# EAGLE design LEDmatrixboard (EAGLE 7.2.0)
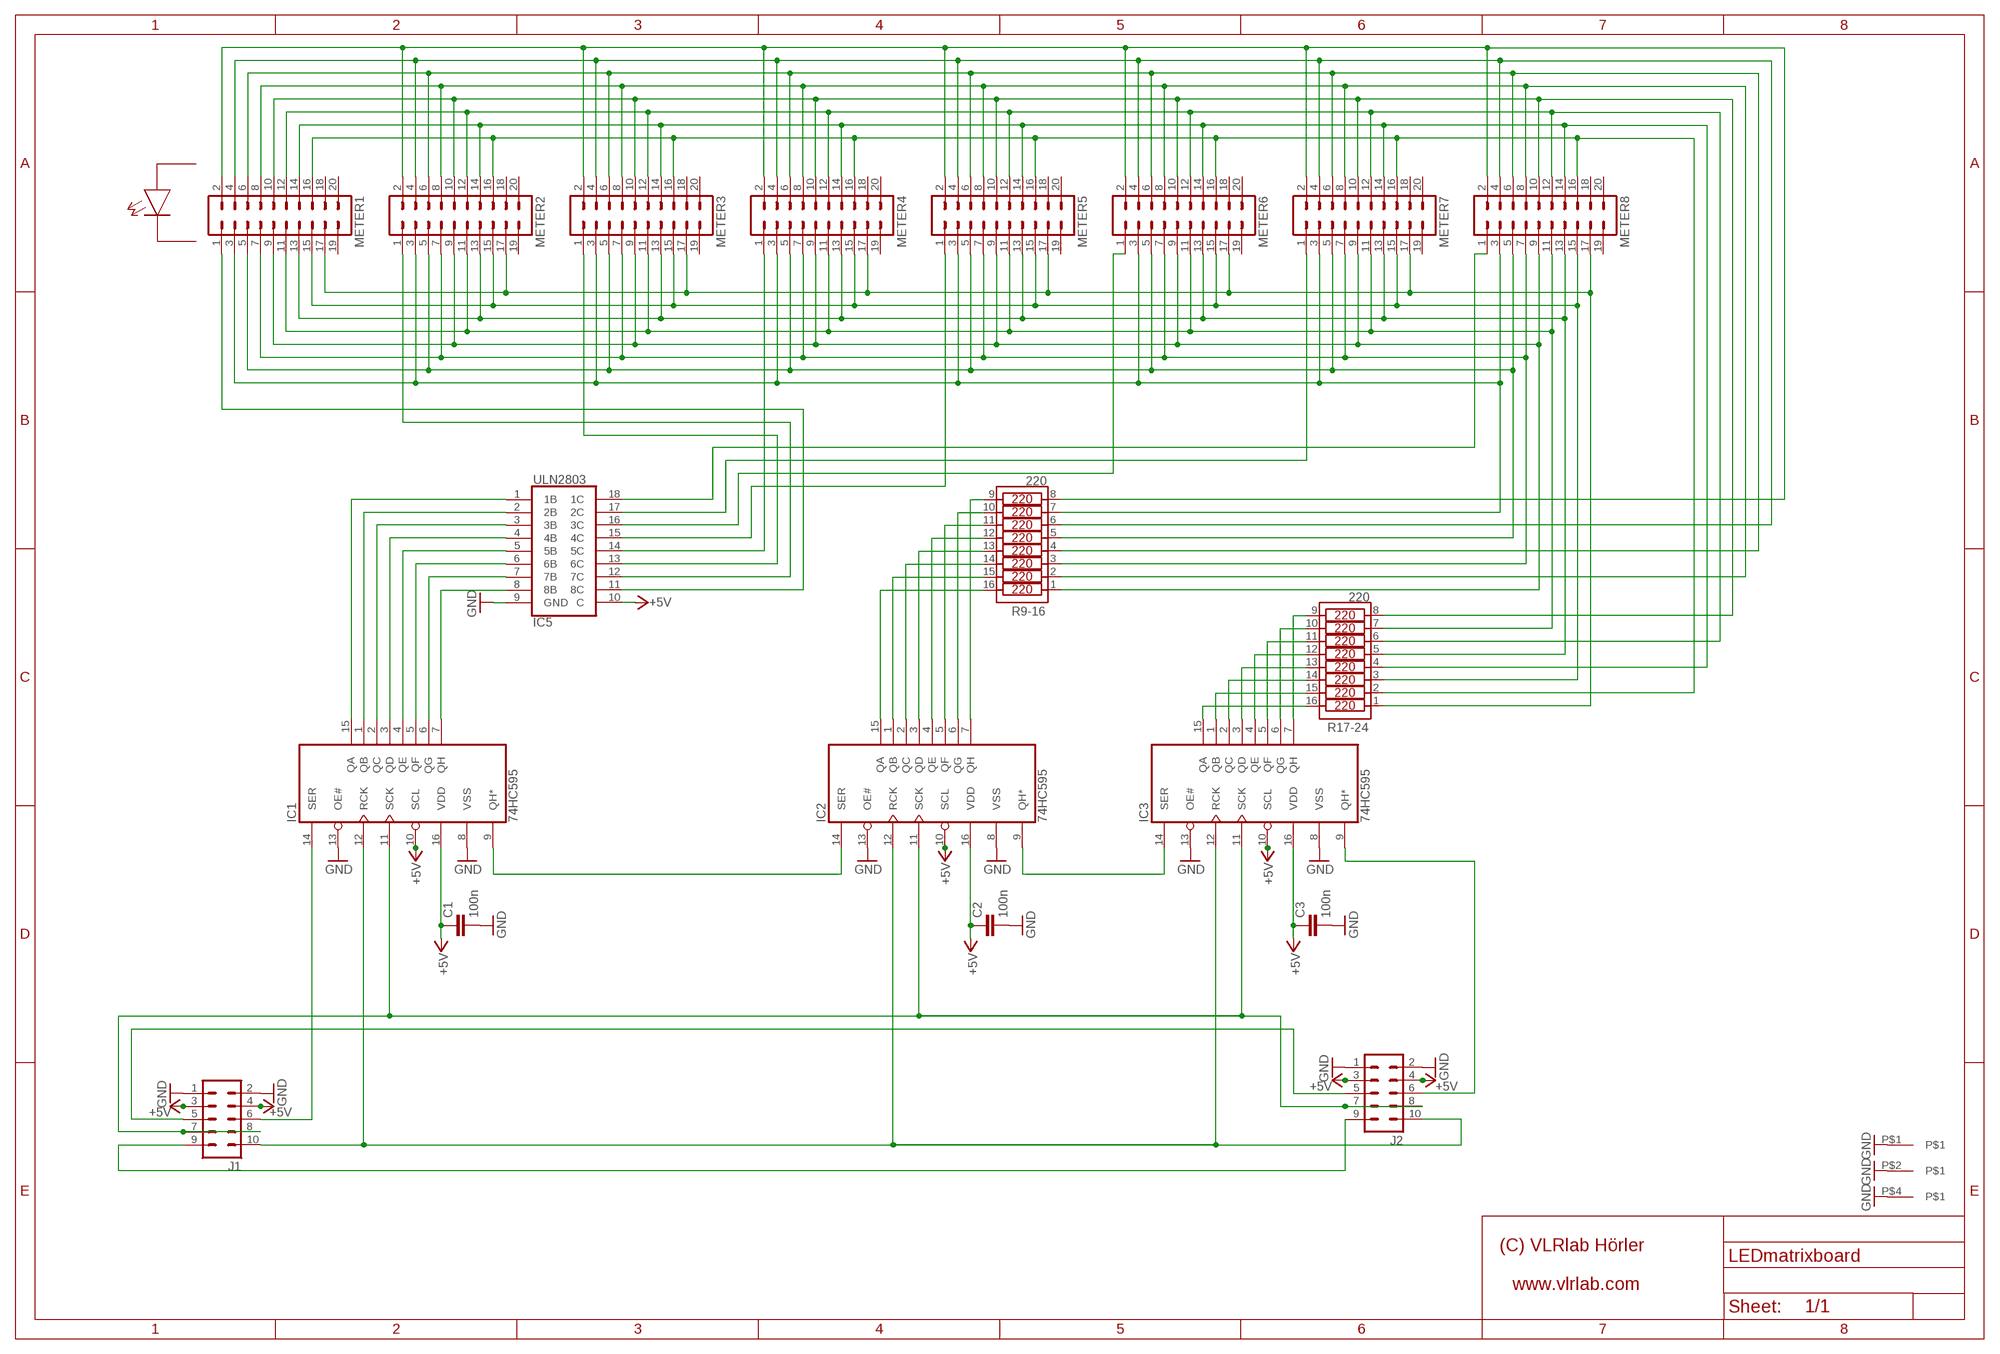
[diagram p0: schematic, sheet 1]

## Parts
C1  100n  C-EU025-030X050  [C025-030X050]
C2  100n  C-EU025-030X050  [C025-030X050]
C3  100n  C-EU025-030X050  [C025-030X050]
IC1  74HC595  74HC595SO16D  [SO16D]
IC2  74HC595  74HC595SO16D  [SO16D]
IC3  74HC595  74HC595SO16D  [SO16D]
IC5  ULN2803  ULN2803SO18W  [SO18W]
J1  ML10  [ML10]
J2  ML10  [ML10]
METER1  ML20  [ML20]
METER2  ML20  [ML20]
METER3  ML20  [ML20]
METER4  ML20  [ML20]
METER5  ML20  [ML20]
METER6  ML20  [ML20]
METER7  ML20  [ML20]
METER8  ML20  [ML20]
R9-16  220  4816P-1SOIC16W  [SOIC16W]
R17-24  220  4816P-1SOIC16W  [SOIC16W]
U$2  MIDIBOX_HALF  [MIDIBOX14X6]

## Nets
+5V [VDD]: C1.1 C2.1 C3.1 IC1.10(SCL) IC1.16(VDD) IC2.10(SCL) IC2.16(VDD) IC3.10(SCL) IC3.16(VDD) IC5.10(C) J1.3 J1.4 J2.3 J2.4
GND: C1.2 C2.2 C3.2 IC1.8(VSS) IC1.13(OE#) IC2.8(VSS) IC2.13(OE#) IC3.8(VSS) IC3.13(OE#) IC5.9(GND) J1.1 J1.2 J2.1 J2.2 U$2.P$1 U$2.P$2 U$2.P$4
N$1: IC1.7(QH) IC5.8(8B)
N$2: METER1.2 METER2.2 METER3.2 METER4.2 METER5.2 METER6.2 METER7.2 METER8.2 R9-16.8
N$3: METER1.3 METER2.3 METER3.3 METER4.3 METER5.3 METER6.3 METER7.3 METER8.3 R9-16.7
N$4: METER1.4 METER2.4 METER3.4 METER4.4 METER5.4 METER6.4 METER7.4 METER8.4 R9-16.6
N$5: METER1.5 METER2.5 METER3.5 METER4.5 METER5.5 METER6.5 METER7.5 METER8.5 R9-16.5
N$6: METER1.6 METER2.6 METER3.6 METER4.6 METER5.6 METER6.6 METER7.6 METER8.6 R9-16.4
N$7: METER1.7 METER2.7 METER3.7 METER4.7 METER5.7 METER6.7 METER7.7 METER8.7 R9-16.3
N$8: METER1.8 METER2.8 METER3.8 METER4.8 METER5.8 METER6.8 METER7.8 METER8.8 R9-16.2
N$9: METER1.9 METER2.9 METER3.9 METER4.9 METER5.9 METER6.9 METER7.9 METER8.9 R9-16.1
N$10: METER1.10 METER2.10 METER3.10 METER4.10 METER5.10 METER6.10 METER7.10 METER8.10 R17-24.8
N$11: METER1.11 METER2.11 METER3.11 METER4.11 METER5.11 METER6.11 METER7.11 METER8.11 R17-24.7
N$12: METER1.12 METER2.12 METER3.12 METER4.12 METER5.12 METER6.12 METER7.12 METER8.12 R17-24.6
N$13: METER1.13 METER2.13 METER3.13 METER4.13 METER5.13 METER6.13 METER7.13 METER8.13 R17-24.5
N$14: METER1.14 METER2.14 METER3.14 METER4.14 METER5.14 METER6.14 METER7.14 METER8.14 R17-24.4
N$15: METER1.15 METER2.15 METER3.15 METER4.15 METER5.15 METER6.15 METER7.15 METER8.15 R17-24.3
N$16: METER1.16 METER2.16 METER3.16 METER4.16 METER5.16 METER6.16 METER7.16 METER8.16 R17-24.2
N$17: METER1.17 METER2.17 METER3.17 METER4.17 METER5.17 METER6.17 METER7.17 METER8.17 R17-24.1
N$18: IC3.15(QA) R17-24.16
N$19: IC3.1(QB) R17-24.15
N$20: IC3.2(QC) R17-24.14
N$21: IC3.3(QD) R17-24.13
N$22: IC3.4(QE) R17-24.12
N$23: IC3.5(QF) R17-24.11
N$24: IC3.6(QG) R17-24.10
N$25: IC3.7(QH) R17-24.9
N$26: IC2.15(QA) R9-16.16
N$27: IC2.1(QB) R9-16.15
N$28: IC2.2(QC) R9-16.14
N$29: IC2.3(QD) R9-16.13
N$30: IC2.4(QE) R9-16.12
N$31: IC2.5(QF) R9-16.11
N$32: IC2.6(QG) R9-16.10
N$33: IC2.7(QH) R9-16.9
N$34: IC1.6(QG) IC5.7(7B)
N$35: IC1.5(QF) IC5.6(6B)
N$36: IC1.4(QE) IC5.5(5B)
N$37: IC1.3(QD) IC5.4(4B)
N$38: IC1.2(QC) IC5.3(3B)
N$39: IC1.1(QB) IC5.2(2B)
N$40: IC1.15(QA) IC5.1(1B)
N$41: IC5.11(8C) METER1.1
N$42: IC5.12(7C) METER2.1
N$43: IC5.13(6C) METER3.1
N$44: IC5.14(5C) METER4.1
N$45: IC5.15(4C) METER5.1
N$46: IC5.16(3C) METER6.1
N$47: IC5.17(2C) METER7.1
N$48: IC5.18(1C) METER8.1
N$49: IC1.9(QH*) IC2.14(SER)
N$50: IC2.9(QH*) IC3.14(SER)
N$65: J1.5 J2.5
N$66: IC1.14(SER) J1.6
N$70: IC3.9(QH*) J2.6
N$71: IC1.11(SCK) IC2.11(SCK) IC3.11(SCK) J1.7 J1.8 J2.7 J2.8
N$72: IC1.12(RCK) IC2.12(RCK) IC3.12(RCK) J1.10 J2.10
N$73: J1.9 J2.9
Unconnected: METER1.18 METER1.19 METER1.20 METER2.18 METER2.19 METER2.20 METER3.18 METER3.19 METER3.20 METER4.18 METER4.19 METER4.20 METER5.18 METER5.19 METER5.20 METER6.18 METER6.19 METER6.20 METER7.18 METER7.19 METER7.20 METER8.18 METER8.19 METER8.20

## Library data of the parts
C1-C3 = rcl:C-EU: CAPACITOR, European symbol
IC1-IC3 = 595-541-165-uln2803:74HC595
IC5 = 595-541-165-uln2803:ULN2803
J1 J2 = con-ml:ML10: HARTING; OC_FARNELL: unknown; OC_NEWARK: unknown
METER1-METER8 = con-ml_Ivan:ML20: HARTING; OC_FARNELL: unknown; OC_NEWARK: unknown
R9-16 R17-24 = Bourns Resistor Array:4816P-1
U$2 = Frames_VLR:MIDIBOX_HALF

## Net classes
1 VDD: width 0.61 mm, drill 0.33 mm, clearance 0.355 mm to class 0, clearance 0.355 mm

## Board
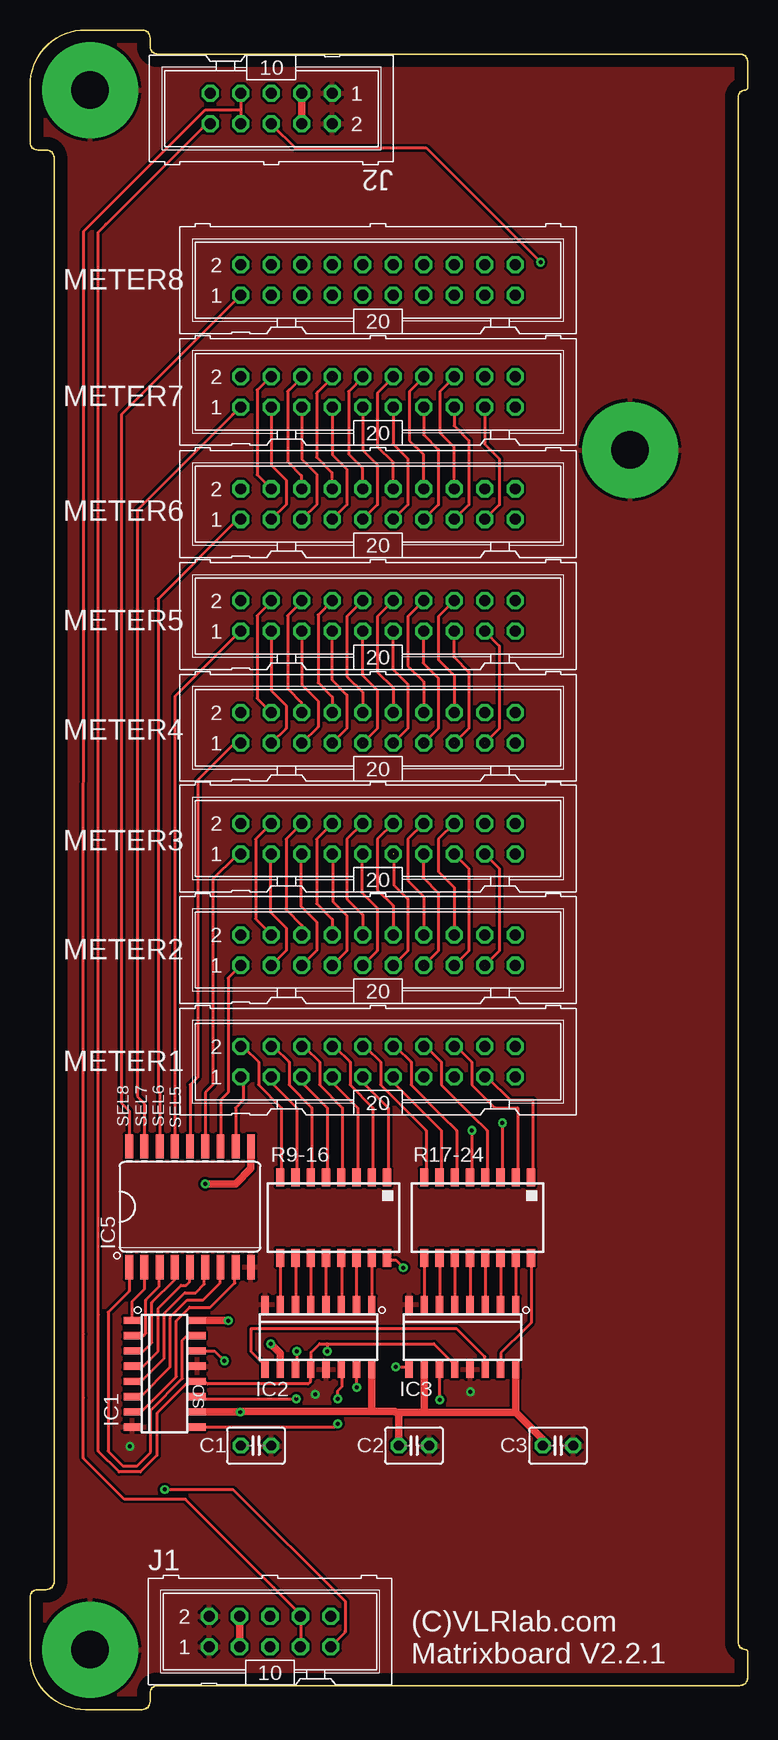
[diagram p1: board, top side]
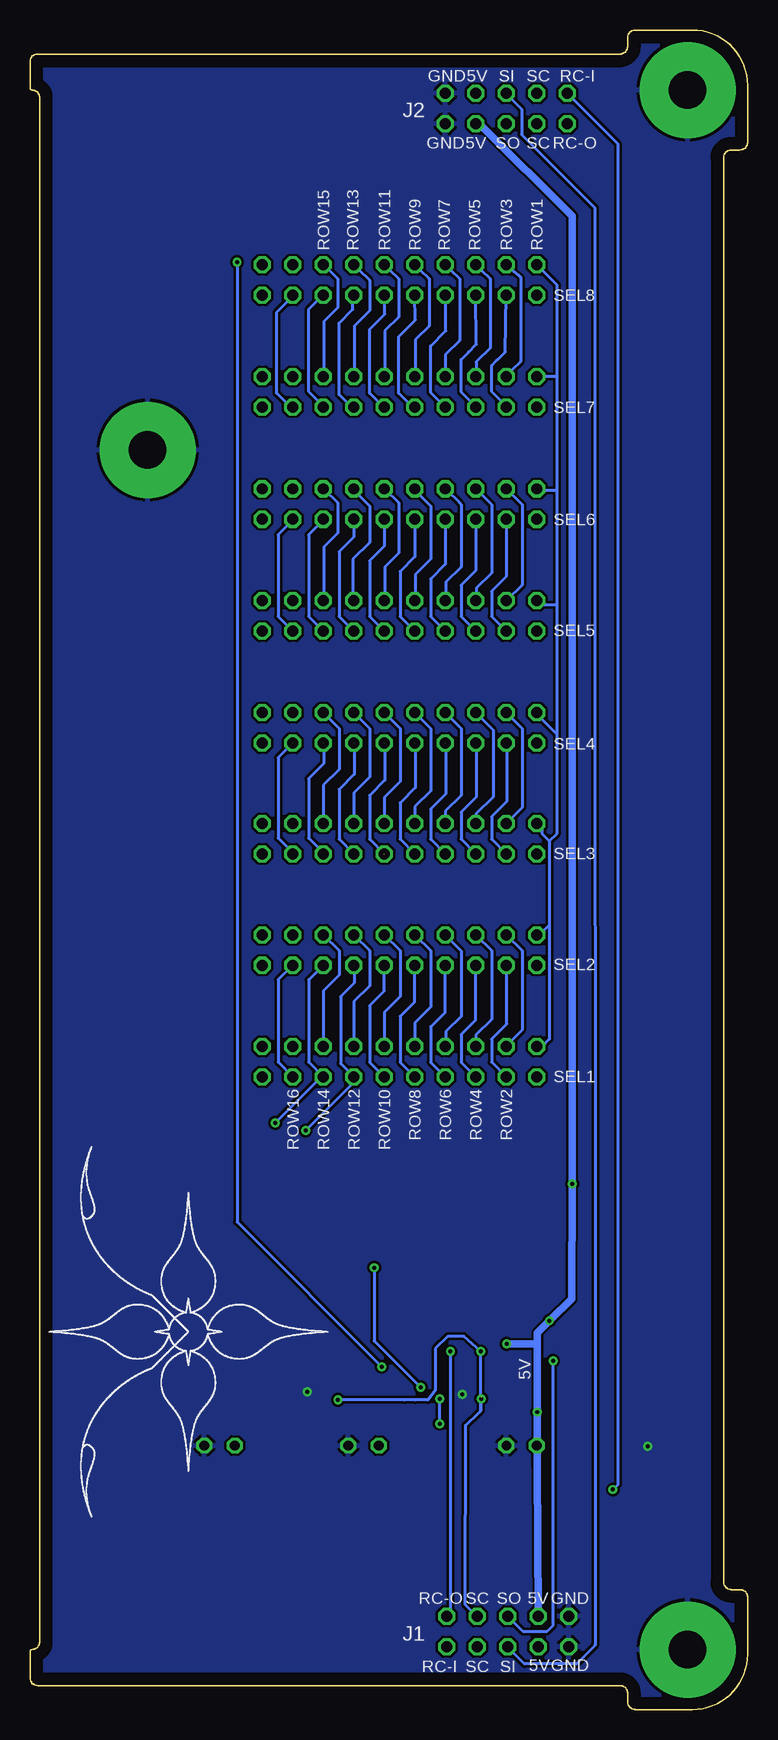
[diagram p2: board, bottom side, seen from below]

Size 59.8 x 140 mm. Coordinates in mm from the lower left corner, seen from the top.
Copper layers (1*16): Top 0.035mm / dielectric 1.5mm / Bottom 0.035mm
Design rules "default": minimum track width 10mil, minimum drill 24mil, track to track 8mil, track to pad 8mil, pad to pad 8mil, via to via 8mil, smd to smd 8mil, copper to edge 40mil, drill to drill 8mil, minimum pad ring 10mil, minimum via ring 8mil, stop-mask expansion 4mil, vias tented up to drill 0mil, thermal gap 10mil

### Footprints (pad centres in the part's own frame; a part is rotated, then mirrored left to right if it is on the bottom)
C025-030X050 = drill 0.813 octagon: 1 -1.27,0; 2 1.27,0
SO16D = smd 0.6 x 1.4: 1 -4.481,-2.764; 2 -3.211,-2.764; 3 -1.941,-2.764; 4 -0.671,-2.764; 5 0.599,-2.764; 6 1.869,-2.764; 7 3.139,-2.764; 8 4.409,-2.764; 9 4.409,2.666; 10 3.139,2.666; 11 1.869,2.666; 12 0.599,2.666; 13 -0.671,2.666; 14 -1.941,2.666; 15 -3.211,2.666; 16 -4.481,2.666
SO18W = smd 0.66 x 2.032: 1 -5.08,-5.029; 2 -3.81,-5.029; 3 -2.54,-5.029; 4 -1.27,-5.029; 5 0,-5.029; 6 1.27,-5.029; 7 2.54,-5.029; 8 3.81,-5.029; 9 5.08,-5.029; 10 5.08,5.029; 11 3.81,5.029; 12 2.54,5.029; 13 1.27,5.029; 14 0,5.029; 15 -1.27,5.029; 16 -2.54,5.029; 17 -3.81,5.029; 18 -5.08,5.029
ML10 = drill 0.914 octagon: 1 -5.08,-1.27; 2 -5.08,1.27; 3 -2.54,-1.27; 4 -2.54,1.27; 5 0,-1.27; 6 0,1.27; 7 2.54,-1.27; 8 2.54,1.27; 9 5.08,-1.27; 10 5.08,1.27
ML20 = drill 0.914 octagon: 1 -11.43,-1.27; 2 -11.43,1.27; 3 -8.89,-1.27; 4 -8.89,1.27; 5 -6.35,-1.27; 6 -6.35,1.27; 7 -3.81,-1.27; 8 -3.81,1.27; 9 -1.27,-1.27; 10 -1.27,1.27; 11 1.27,-1.27; 12 1.27,1.27; 13 3.81,-1.27; 14 3.81,1.27; 15 6.35,-1.27; 16 6.35,1.27; 17 8.89,-1.27; 18 8.89,1.27; 19 11.43,-1.27; 20 11.43,1.27
SOIC16W = smd 0.7 x 1.5: 1 -4.445,-3.346; 2 -3.175,-3.346; 3 -1.905,-3.346; 4 -0.635,-3.346; 5 0.635,-3.346; 6 1.905,-3.346; 7 3.175,-3.346; 8 4.445,-3.346; 9 4.445,3.346; 10 3.175,3.346; 11 1.905,3.346; 12 0.635,3.346; 13 -0.635,3.346; 14 -1.905,3.346; 15 -3.175,3.346; 16 -4.445,3.346
MIDIBOX14X6 = drill 3.1 pad 8: P$1 5,135; P$2 50,105; P$4 5,5

### Placement (x,y rotation side)
C1  18.83,22 0 top
C2  32,22 0 top
C3  44,22 0 top
IC1  11.27,27.95 270 top
IC2  24,31 180 top
IC3  36,31 180 top
IC5  13.34,41.91 0 top
J1  20,6.5 0 top
J2  20.11,133.45 180 top
METER1  29,54 0 top
METER2  29,63.31 0 top
METER3  29,72.6 0 top
METER4  29,81.83 0 top
METER5  29,91.15 0 top
METER6  29,100.48 0 top
METER7  29,109.84 0 top
METER8  29,119.15 0 top
R9-16  25.3,41 180 top
R17-24  37.3,41 180 top
U$2  0,0 0 top
U$3  [VLRLAB]  34.95,16.05 90 bottom
U$4  [VLRLAB]  50.8,78.03 270 top
U$5  [VLRLAB]  53.85,79.45 270 bottom

### Tracks (layer width: path | path; a pad name or v marks a point on that pad's centre or on a via)
+5V  (via drill 0.33)
  Top 0.61: 40.49,24.77 42.67,22.58 42.67,21.91 C3.1 | 40.49,24.77 40.49,27.94 IC3.16 | 30.56,24.77 30.48,24.77 | 30.73,24.77 30.73,22.23 C2.1 | 30.73,24.77 30.56,24.77 | 28.47,24.85 IC2.16 | 32.87,24.77 32.87,28.3 IC3.10 | 30.48,24.77 30.56,24.77 | 30.56,24.77 30.73,24.77 | 30.73,24.77 32.87,24.77 | 30.73,24.77 32.87,24.77 | 32.87,24.77 40.49,24.77 | J2.4 22.66,132.72 22.66,134.62 J2.3 | J1.3 17.46,5.65 17.46,7.56 J1.4 | IC5.10 18.41,45.09 17.14,43.81 v14.61,43.81 | IC1.16 16.49,32.43 v16.51,32.41 | IC1.10 17.5,24.81 v17.53,24.79 17.59,24.85 28.47,24.85 | IC2.10 20.86,29.68 v20.07,30.48 | 28.47,24.85 30.39,24.85 30.48,24.77
  Bottom 0.61: J1.4 17.46,7.94 17.53,20.13 17.53,21.96 C1.1 17.53,22.04 v17.53,24.79 17.53,30.43 | J2.4 22.23,132.08 14.61,124.46 v14.61,43.81 14.66,34.21 16.46,32.46 v16.51,32.41 17.53,31.39 17.53,30.43 | v20.07,30.48 17.58,30.48 17.53,30.43
GND  (via drill 0.33)
  other vias: 36.7,26.48 23.77,26.26 8.33,21.95
  pour Bottom: -3.81,142.24 64.77,142.24 64.77,-1.27 -3.81,-1.27
  pour Top: -2.54,140.97 66.04,140.97 66.04,-2.54 -2.54,-2.54
N$1
  Top 0.254: IC1.7 9.27,24.81 12.19,27.74 12.19,32.41 13.31,33.53 15.04,33.53 17.07,35.56 17.07,36.8 IC5.8
N$2
  Top 0.254: R9-16.8 20.95,44.45 20.95,50.16 19.05,52.07 19.05,53.98 17.78,55.24 METER1.2
  Bottom 0.254: 16.51,65.41 17.14,64.77 METER2.2 | 16.51,72.39 16.51,65.41 | 16.51,72.39 17.14,73.03 17.14,73.66 METER3.2 | 15.88,81.28 17.14,82.55 METER4.2 | 15.88,81.28 15.88,73.03 16.51,72.39 | 15.88,92.08 17.14,92.08 METER5.2 | 15.88,81.28 15.88,92.08 | 15.88,101.6 17.14,101.6 METER6.2 | 15.88,92.08 15.88,101.6 | 15.88,111.12 17.14,111.12 METER7.2 | 15.88,101.6 15.88,111.12 | 15.88,111.12 15.88,118.75 17.14,120.02 METER8.2 | 16.51,65.41 16.51,55.88 17.14,55.24 METER1.2
N$3
  Top 0.254: R9-16.7 22.23,44.45 22.23,50.16 19.68,52.7 METER1.3 | METER7.3 20.11,103.72 21.34,102.49 21.34,100.44 METER6.3 | METER5.3 20.11,84.92 21.34,83.69 21.34,81.79 METER4.3 | METER3.3 20.07,71.29 20.07,66.42 21.34,65.15 21.34,63.27 METER2.3
  Bottom 0.254: METER8.3 20.19,113.16 20.83,112.52 20.95,112.42 21.34,112.04 21.34,109.87 20.32,108.86 METER7.3 | METER6.3 20.11,94.44 21.34,93.22 21.34,91.11 METER5.3 | METER4.3 20.07,80.52 20.07,75.69 21.34,74.42 21.34,72.56 METER3.3 20.15,71.33 | METER1.3 20.11,52.75 21.34,53.98 21.34,55.88 20.07,57.15 20.07,62 METER2.3
N$4
  Top 0.254: R9-16.6 23.5,44.45 23.5,50.16 21.59,52.07 21.59,53.98 20.32,55.24 METER1.4 | METER7.4 20.05,111.11 18.92,109.98 18.92,102.94 METER6.4 | METER5.4 20.11,92.37 18.92,91.19 18.92,84.29 METER4.4 | METER3.4 18.8,72.56 18.8,65.91 20.11,64.6 METER2.4
  Bottom 0.254: METER7.4 20.11,111.19 19.68,111.61 18.92,112.37 18.92,119.38 19.68,120.02 METER8.4 | METER6.4 20.09,101.75 18.8,100.46 18.8,93.73 METER5.4 | METER4.4 18.8,81.79 18.8,75.18 METER3.4 | METER2.4 18.8,63.27 18.8,56.64 20.11,55.33 METER1.4
N$5
  Top 0.254: R9-16.5 24.77,44.45 24.77,50.16 22.23,52.7 METER1.5 | METER7.5 22.65,104.22 23.88,103 23.88,100.44 METER6.5 | METER5.5 22.65,85.43 24,84.07 24,81.91 METER4.5 | METER3.5 22.61,71.29 22.61,66.93 23.88,65.66 23.88,63.27 METER2.5
  Bottom 0.254: METER8.5 22.61,113.79 23.24,113.16 23.88,112.52 23.88,109.82 22.86,108.81 METER7.5 | METER6.5 22.65,94.95 23.88,93.73 23.88,91.11 METER5.5 | METER4.5 22.61,80.52 22.61,76.07 23.88,74.8 23.88,72.56 METER3.5 22.69,71.33 | METER1.5 23.88,53.96 23.88,56.26 22.67,57.47 22.67,62.02 METER2.5
N$6
  Top 0.254: R9-16.4 26.04,44.45 26.04,50.16 24.13,52.07 24.13,53.98 22.86,55.24 METER1.6 | METER7.6 22.65,111.04 21.59,109.98 21.46,109.86 21.46,104.01 22.61,102.87 22.61,101.79 METER6.6 | METER5.6 22.65,92.37 21.46,91.19 21.46,85.09 22.61,83.95 22.61,83.14 METER4.6 | METER3.6 21.34,72.56 21.34,66.8 21.34,66.67 22.65,65.36 METER2.6
  Bottom 0.254: METER7.6 22.61,111.12 22.61,112.35 21.46,113.48 21.46,119.25 22.23,120.02 METER8.6 | METER6.6 22.63,101.75 21.34,100.46 21.34,94.74 22.61,93.47 22.61,92.46 METER5.6 | METER4.6 21.21,81.66 21.21,76.07 22.65,74.63 METER3.6 | METER2.6 21.34,63.27 21.34,57.53 22.65,56.22 METER1.6
N$7  (1 unrouted)
  Top 0.254: R9-16.3 27.3,44.45 27.3,50.16 24.77,52.7 METER1.7 | METER7.7 25.19,104.6 26.42,103.38 26.42,100.44 METER6.7 | METER5.7 25.15,89.84 25.15,85.85 26.42,84.58 26.42,81.79 METER4.7 | METER3.7 25.27,71.25 25.27,67.31 26.42,66.17 26.42,63.25 26.4,63.25 METER2.7
  Bottom 0.254: METER8.7 25.15,117.86 25.15,117.47 25.15,114.94 26.42,113.67 26.42,109.77 25.4,108.75 METER7.7 | METER6.7 25.19,95.46 26.42,94.23 26.42,91.11 METER5.7 | METER4.7 25.15,80.52 25.15,76.33 26.42,75.06 26.42,72.56 METER3.7 25.23,71.33 | METER1.7 26.42,53.96 26.42,56.9 25.21,58.1 25.21,62.02 METER2.7
N$8  (1 unrouted)
  Top 0.254: R9-16.2 28.57,44.45 28.57,50.16 26.67,52.07 26.67,53.98 25.4,55.24 METER1.8 | METER7.8 25.18,111.04 24,109.86 23.88,109.73 23.88,104.39 25.15,103.12 25.15,101.79 METER6.8 | METER5.8 24,91.23 24,85.6 25.19,84.41 METER4.8 | METER3.8 23.88,72.56 23.88,67.18 25.19,65.87 METER2.8
  Bottom 0.254: METER8.8 24.77,120.02 24,119.25 24,114.11 25.18,112.93 METER7.8 | METER6.8 25.17,101.75 24,100.58 23.88,100.46 23.88,95.25 25.15,93.98 25.15,92.46 METER5.8 | METER4.8 23.88,81.79 23.88,76.2 25.19,74.89 METER3.8 | METER2.8 25.19,64.56 23.88,63.25 23.88,57.78 25.15,56.52 25.15,55.31 METER1.8
N$9  (1 unrouted)
  Top 0.254: R9-16.1 29.84,44.45 29.84,50.16 27.3,52.7 METER1.9 | METER7.9 27.73,104.98 28.96,103.76 28.96,100.44 METER6.9 | METER5.9 27.69,89.84 27.69,86.23 28.96,84.96 28.96,81.79 METER4.9 | METER3.9 27.69,71.29 27.69,68.07 28.96,66.8 28.96,63.25 28.94,63.25 METER2.9
  Bottom 0.254: METER8.9 27.69,115.82 28.57,114.94 29.08,114.43 29.08,109.73 27.94,108.58 METER7.9 | METER6.9 27.73,96.09 28.96,94.87 28.96,91.11 METER5.9 | METER4.9 27.69,80.52 27.69,76.83 28.96,75.56 28.96,72.56 METER3.9 27.77,71.33 | METER1.9 28.96,53.96 28.96,57.78 27.75,58.99 27.75,62.02 METER2.9
N$10
  Top 0.254: R17-24.8 33.02,44.45 33.02,48.26 29.21,52.07 29.21,53.98 27.94,55.24 METER1.10 | METER7.10 27.73,111.04 26.54,109.86 26.54,104.65 27.69,103.5 27.69,101.79 METER6.10 | METER5.10 26.42,91.11 26.42,86.11 27.73,84.79 METER4.10 | METER3.10 26.42,72.56 26.42,67.56 27.73,66.25 METER2.10
  Bottom 0.254: METER7.10 27.69,111.12 27.69,114.17 26.54,115.32 26.54,119.25 27.3,120.02 METER8.10 | METER6.10 27.73,101.64 26.54,100.46 26.42,100.33 26.42,95.89 27.69,94.61 27.69,92.46 METER5.10 | METER4.10 26.42,81.79 26.42,76.58 27.73,75.27 METER3.10 | METER2.10 26.42,63.27 26.42,58.55 27.73,57.23 METER1.10
N$11  (2 unrouted)
  Top 0.254: R17-24.7 34.29,44.45 34.29,48.26 33.66,48.9 29.84,52.7 METER1.11 | METER7.11 30.27,105.49 31.5,104.27 31.5,100.44 METER6.11 | METER5.11 30.23,89.84 30.23,86.74 31.5,85.47 31.5,81.79 METER4.11 | 30.31,71.33 30.35,71.29 | METER3.11 30.35,71.25 30.35,68.71 31.5,67.56 31.5,63.25 30.29,62.04 METER2.11
  Bottom 0.254: METER8.11 30.23,116.33 30.86,115.7 31.5,115.06 31.5,109.73 30.48,108.71 METER7.11 | METER6.11 30.27,96.98 31.5,95.76 31.5,91.11 METER5.11 | METER4.11 30.23,80.52 30.23,77.47 31.5,76.2 31.5,72.56 METER3.11 | METER1.11 31.5,53.96 31.5,58.67 30.29,59.88 30.27,59.9 METER2.11
N$12
  Top 0.254: R17-24.6 35.56,44.45 35.56,48.26 34.29,49.53 31.75,52.07 31.75,53.98 30.48,55.24 METER1.12 | METER7.12 30.27,111.04 28.96,109.73 28.96,105.28 30.23,104.01 30.23,101.79 METER6.12 | METER5.12 28.96,91.11 28.96,86.49 30.27,85.17 METER4.12 | METER3.12 28.96,72.56 28.96,68.33 30.27,67.01 METER2.12
  Bottom 0.254: METER7.12 30.23,111.12 30.23,114.94 29.08,116.08 29.08,119.25 29.84,120.02 METER8.12 | METER6.12 30.25,101.75 29.08,100.58 29.08,96.39 30.23,95.25 30.23,92.46 METER5.12 | METER4.12 28.96,81.79 28.96,77.34 30.27,76.03 METER3.12 | METER2.12 28.96,63.27 28.96,59.44 30.27,58.12 METER1.12
N$13  (via drill 0.33)  (2 unrouted)
  Top 0.254: v36.83,48.26 36.83,44.45 R17-24.5 | METER7.13 32.81,106.25 34.04,105.03 34.04,100.44 METER6.13 | METER5.13 32.77,89.84 32.77,87.25 34.04,85.98 34.04,81.79 METER4.13 | METER3.13 32.77,71.29 32.77,69.34 34.04,68.07 34.04,63.25 32.83,62.04 METER2.13
  Bottom 0.254: v36.83,48.26 33.02,52.07 33.02,52.7 | 33.02,52.7 METER1.13 | 33.02,52.7 METER1.13 | METER8.13 32.89,117.98 32.89,116.71 34.04,115.57 34.04,109.6 33.02,108.58 METER7.13 | METER6.13 32.81,97.75 34.04,96.52 34.04,91.11 METER5.13 | METER4.13 32.77,80.52 32.77,77.98 34.04,76.71 34.04,72.56 METER3.13 | 32.83,62.04 32.77,61.98 32.77,60.58 33.91,59.44 33.91,53.85 32.81,52.75 METER1.13
N$14
  Top 0.254: R17-24.4 38.1,44.45 38.1,48.26 36.83,49.53 34.29,52.07 34.29,53.98 33.02,55.24 METER1.14 | METER7.14 32.81,111.04 31.62,109.86 31.62,105.79 32.77,104.65 32.77,101.79 METER6.14 | METER5.14 31.5,91.11 31.5,87 32.81,85.68 METER4.14 | METER3.14 31.5,72.56 31.5,69.09 32.81,67.77 METER2.14
  Bottom 0.254: METER7.14 32.77,111.12 32.77,115.32 31.5,116.59 31.5,119.13 32.38,120.02 METER8.14 | METER6.14 32.81,101.64 31.5,100.33 31.5,97.28 32.89,95.89 32.89,92.5 METER5.14 | METER4.14 31.5,81.79 31.5,77.72 32.81,76.41 METER3.14 | METER2.14 31.5,63.27 31.5,60.33 32.81,59.01 METER1.14
N$15  (via drill 0.33)  (1 unrouted)
  Top 0.254: v39.37,48.9 39.37,44.45 R17-24.3 | METER7.15 35.35,107.02 36.58,105.79 36.58,100.44 METER6.15 | METER5.15 35.31,89.84 35.31,87.76 36.58,86.49 36.58,81.79 METER4.15 | METER3.15 36.58,70.1 36.58,63.25 35.37,62.04 METER2.15
  Bottom 0.254: 35.56,52.7 v39.37,48.9 | 35.56,52.7 METER1.15 | 35.56,52.7 METER1.15 | METER8.15 35.56,117.73 36.58,116.71 36.58,109.86 35.56,108.84 METER7.15 | METER6.15 35.35,99.14 36.58,97.92 36.58,91.11 METER5.15 | METER4.15 35.31,80.52 35.31,78.87 36.58,77.6 36.58,72.64 35.35,71.42 METER3.15 | METER2.15 36.58,60.81 36.58,53.98 35.35,52.75 METER1.15
N$16
  Top 0.254: R17-24.2 40.64,44.45 40.64,50.16 38.73,50.16 36.83,52.07 36.83,53.98 35.56,55.24 METER1.16 | METER7.16 35.35,111.04 34.16,109.86 34.16,106.43 35.31,105.28 35.31,101.79 METER6.16 | METER5.16 34.04,91.11 34.04,87.5 35.35,86.19 METER4.16 | METER3.16 34.04,72.56 34.04,69.85 35.35,68.54 METER2.16
  Bottom 0.254: METER7.16 35.31,111.12 35.31,115.7 34.16,116.84 34.16,119.25 34.92,120.02 METER8.16 | METER6.16 35.33,101.75 34.16,100.58 34.16,98.04 35.31,96.9 35.31,92.46 METER5.16 | METER4.16 34.04,81.79 34.04,78.36 35.35,77.05 METER3.16 | METER2.16 34.04,63.27 34.04,61.21 35.35,59.9 METER1.16
N$17  (2 unrouted)
  Top 0.254: R17-24.1 41.91,44.45 41.91,50.8 40.01,50.8 38.1,52.7 METER1.17 | METER7.17 37.89,105.49 39.12,104.27 39.12,100.44 METER6.17 | METER5.17 39.12,88.65 39.12,81.79 METER4.17 | METER3.17 39.12,70.1 39.12,63.25 37.91,62.04 METER2.17
  Bottom 0.254: METER8.17 37.97,117.73 39.24,116.46 39.24,109.73 38.1,108.58 METER7.17 | METER6.17 37.89,99.14 39.12,97.92 39.12,91.11 METER5.17 | METER4.17 39.12,79.34 39.12,72.64 37.89,71.42 METER3.17 | 37.91,62.04 39.12,60.83 39.12,53.98 37.89,52.75 METER1.17
N$18
  Top 0.254: IC3.15 39.24,28.45 39.24,29.72 41.27,31.75 41.76,32.23 41.76,37.34 R17-24.16
N$19
  Top 0.254: IC3.1 40.49,34.29 40.49,37.47 R17-24.15
N$20
  Top 0.254: IC3.2 39.22,34.29 39.22,37.47 R17-24.14
N$21
  Top 0.254: IC3.3 37.95,34.29 37.95,37.47 R17-24.13
N$22
  Top 0.254: IC3.4 36.68,34.29 36.68,37.47 R17-24.12
N$23
  Top 0.254: IC3.5 35.41,34.29 35.41,37.47 R17-24.11
N$24
  Top 0.254: IC3.6 34.14,34.29 34.14,37.47 R17-24.10
N$25
  Top 0.254: IC3.7 32.87,34.29 32.87,37.47 R17-24.9
N$26  (via drill 0.33)
  Top 0.254: v27.23,26.85 27.23,27.94 IC2.15 | v31.11,36.83 30.48,37.47 29.84,37.47 R9-16.16
  Bottom 0.254: v27.23,26.85 31.11,30.71 v31.11,36.83
N$27
  Top 0.254: IC2.1 28.47,34.29 28.47,37.47 R9-16.15
N$28
  Top 0.254: IC2.2 27.2,34.29 27.2,37.47 R9-16.14
N$29
  Top 0.254: IC2.3 25.96,34.29 25.96,37.47 R9-16.13
N$30
  Top 0.254: IC2.4 24.66,34.29 24.66,37.47 R9-16.12
N$31
  Top 0.254: IC2.5 23.39,34.29 23.39,37.47 R9-16.11
N$32
  Top 0.254: IC2.6 22.15,34.29 22.15,37.47 R9-16.10
N$33
  Top 0.254: IC2.7 20.85,34.29 20.85,37.47 R9-16.9
N$34
  Top 0.254: IC1.6 9.22,26.08 11.68,28.55 11.68,32.72 13.11,34.14 14.43,34.14 15.85,35.56 15.85,36.85 IC5.7
N$35
  Top 0.254: IC1.5 9.27,27.35 11.18,29.26 11.18,33.02 12.9,34.75 13.82,34.75 14.53,35.46 14.53,36.8 IC5.6
N$36
  Top 0.254: IC1.4 9.42,28.62 10.67,29.87 10.67,33.43 12.6,35.36 13.01,35.36 13.31,35.66 13.31,36.85 IC5.5
N$37
  Top 0.254: IC1.3 9.47,29.89 10.06,30.48 10.16,30.58 10.16,33.93 12.09,35.87 12.09,36.85 IC5.4
N$38
  Top 0.254: IC1.2 9.42,31.16 9.65,31.39 9.65,34.14 10.77,35.26 10.77,36.85 IC5.3
N$39
  Top 0.254: IC1.1 8.5,34 9.55,35.05 9.55,36.85 IC5.2
N$40
  Top 0.254: IC5.1 8.26,34.87 6.5,33.12 6.5,21.54 7.72,20.32 8.94,20.32 10.06,21.44 10.06,24.94 12.7,27.58 12.7,30.79 13.11,31.19 13.9,31.19 IC1.15
N$41
  Top 0.254: METER1.1 17.78,52.52 17.78,50.8 17.14,50.16 IC5.11
N$42
  Top 0.254: METER2.1 17.14,61.59 16.51,60.96 16.51,51.44 15.88,50.8 IC5.12
N$43
  Top 0.254: METER3.1 17.14,71.12 15.24,69.22 15.24,52.07 14.61,51.44 IC5.13
N$44
  Top 0.254: METER4.1 17.14,80.64 13.97,77.47 13.97,52.7 13.34,52.07 IC5.14
N$45
  Top 0.254: METER5.1 17.14,89.53 12.06,84.45 12.06,51.99 IC5.15
N$46
  Top 0.254: METER6.1 17.14,99.06 10.67,92.58 10.69,51.49 10.79,51.38 IC5.16
N$47
  Top 0.254: METER7.1 16.89,107.95 8.94,100 8.94,51.1 9.53,50.52 IC5.17
N$48
  Top 0.254: METER8.1 17.14,117.47 7.62,107.95 7.62,50.55 8.26,49.91 IC5.18
N$49  (via drill 0.33)
  Top 0.254: IC1.9 25.37,23.54 v25.65,23.82 | v25.65,25.91 25.65,26.57 26.01,26.92 26.01,28.27 IC2.14
  Bottom 0.254: v25.65,23.82 v25.65,25.91
N$50
  Top 0.254: IC2.9 19.68,28.57 18.41,29.84 18.41,31.75 35.56,31.75 37.91,29.4 37.91,28.77 IC3.14
N$65
  Bottom 0.254: J1.5 19.89,5.08 19.86,5.08 18.59,3.81 14.25,3.81 12.7,5.36 12.7,5.44 12.72,125.18 18.84,131.29 18.83,133.38 19.7,134.25 20.09,134.66 J2.5
N$66  (via drill 0.33)
  Top 0.254: IC1.14 15.37,29.89 15.9,29.36 v16.2,29.06
  Bottom 0.254: J1.6 18.73,6.5 16.71,6.5 16.2,7.01 v16.2,29.06
N$70  (via drill 0.33)
  Top 0.254: v30.48,28.57 31.75,28.57 IC3.9 | v42.55,120.65 33.02,130.18 22.09,130.18 20.18,132.08 J2.6
  Bottom 0.254: v30.48,28.57 42.55,40.64 v42.55,120.65
N$71  (via drill 0.33)  (1 unrouted)
  Top 0.254: J2.7 17.57,134.55 17.57,132.65 J2.8 17.57,133.34 16.51,133.35 14.61,133.35 4.5,123.24 4.45,31.29 4.45,26.01 4.45,20.95 7.87,17.53 12.95,17.53 20.32,10.16 22.58,7.9 J1.8 22.55,7.62 22.55,5.71 J1.7 | v22.23,29.84 22.23,28.57 IC2.11 | v34.14,25.81 34.14,27.99 IC3.11 | IC1.11 14.1,26.08 14.17,25.91 22.15,25.91 v22.2,25.91 22.2,26.03
  Bottom 0.254: 22.23,24.92 22.35,24.79 23.5,23.7 23.52,8.74 22.89,8.1 J1.8 | v34.14,25.81 28.6,25.81 27.71,25.81 26.62,25.81 26.01,26.62 26.01,26.67 26.01,30.1 24.97,31.11 23.65,31.11 v22.23,29.84 22.23,24.92 | 22.23,24.92 22.2,24.95 22.2,26.08
N$72  (via drill 0.33)
  Top 0.254: 24.77,30.48 24.13,30.48 23.43,29.78 23.43,28.57 23.5,28.57 IC2.12 23.37,28.3 23.37,27.33 23.16,27.13 14.78,27.13 14.56,27.35 IC1.12 13.91,27.33 13.21,27.33 10.57,24.69 10.57,21.18 9.2,19.81 7.42,19.81 5.69,21.54 5.69,32.92 5.69,123.17 6.3,123.77 6.35,123.83 14.61,132.08 J2.10 | 24.77,30.48 33.66,30.48 35.56,28.57 IC3.12 | 24.77,30.48 v24.77,29.84
  Bottom 0.254: v24.77,29.84 24.77,8.26 J1.10
N$73  (via drill 0.33)
  Top 0.254: 26.29,6.45 25.45,5.61 J1.9 | 26.29,6.45 26.29,6.58 26.29,6.45 | 26.29,6.45 26.29,9 16.9,18.34 v11.23,18.34
  Bottom 0.254: J2.9 14.99,134.69 14.62,134.32 10.83,130.54 10.82,23.77 10.82,18.75 v11.23,18.34

### Text on the board
tNames: SEL8 | SEL7 | SEL6 | SEL5 | SO | (C)VLRlab.com / Matrixboard V2.2.1
bNames: RC-I | SC | SI | 5V | GND | J2 | RC-O | SC | SO | 5V | GND | ROW1 | ROW3 | ROW5 | ROW7 | ROW9 | ROW11 | ROW13 | ROW15 | SEL8 | SEL7 | SEL6 | SEL5 | SEL4 | SEL3 | SEL2 | SEL1 | ROW2 | ROW4 | ROW6 | ROW8 | ROW10 | ROW12 | ROW14 | ROW16 | 5V | GND | 5V | SO | SC | RC-O | J1 | GND | 5V | SI | SC | RC-I